# EAGLE schematic TommyPROM-nano (EAGLE 8.0.0)
Tom's EPROM programmer hosted on Arduino Nano.
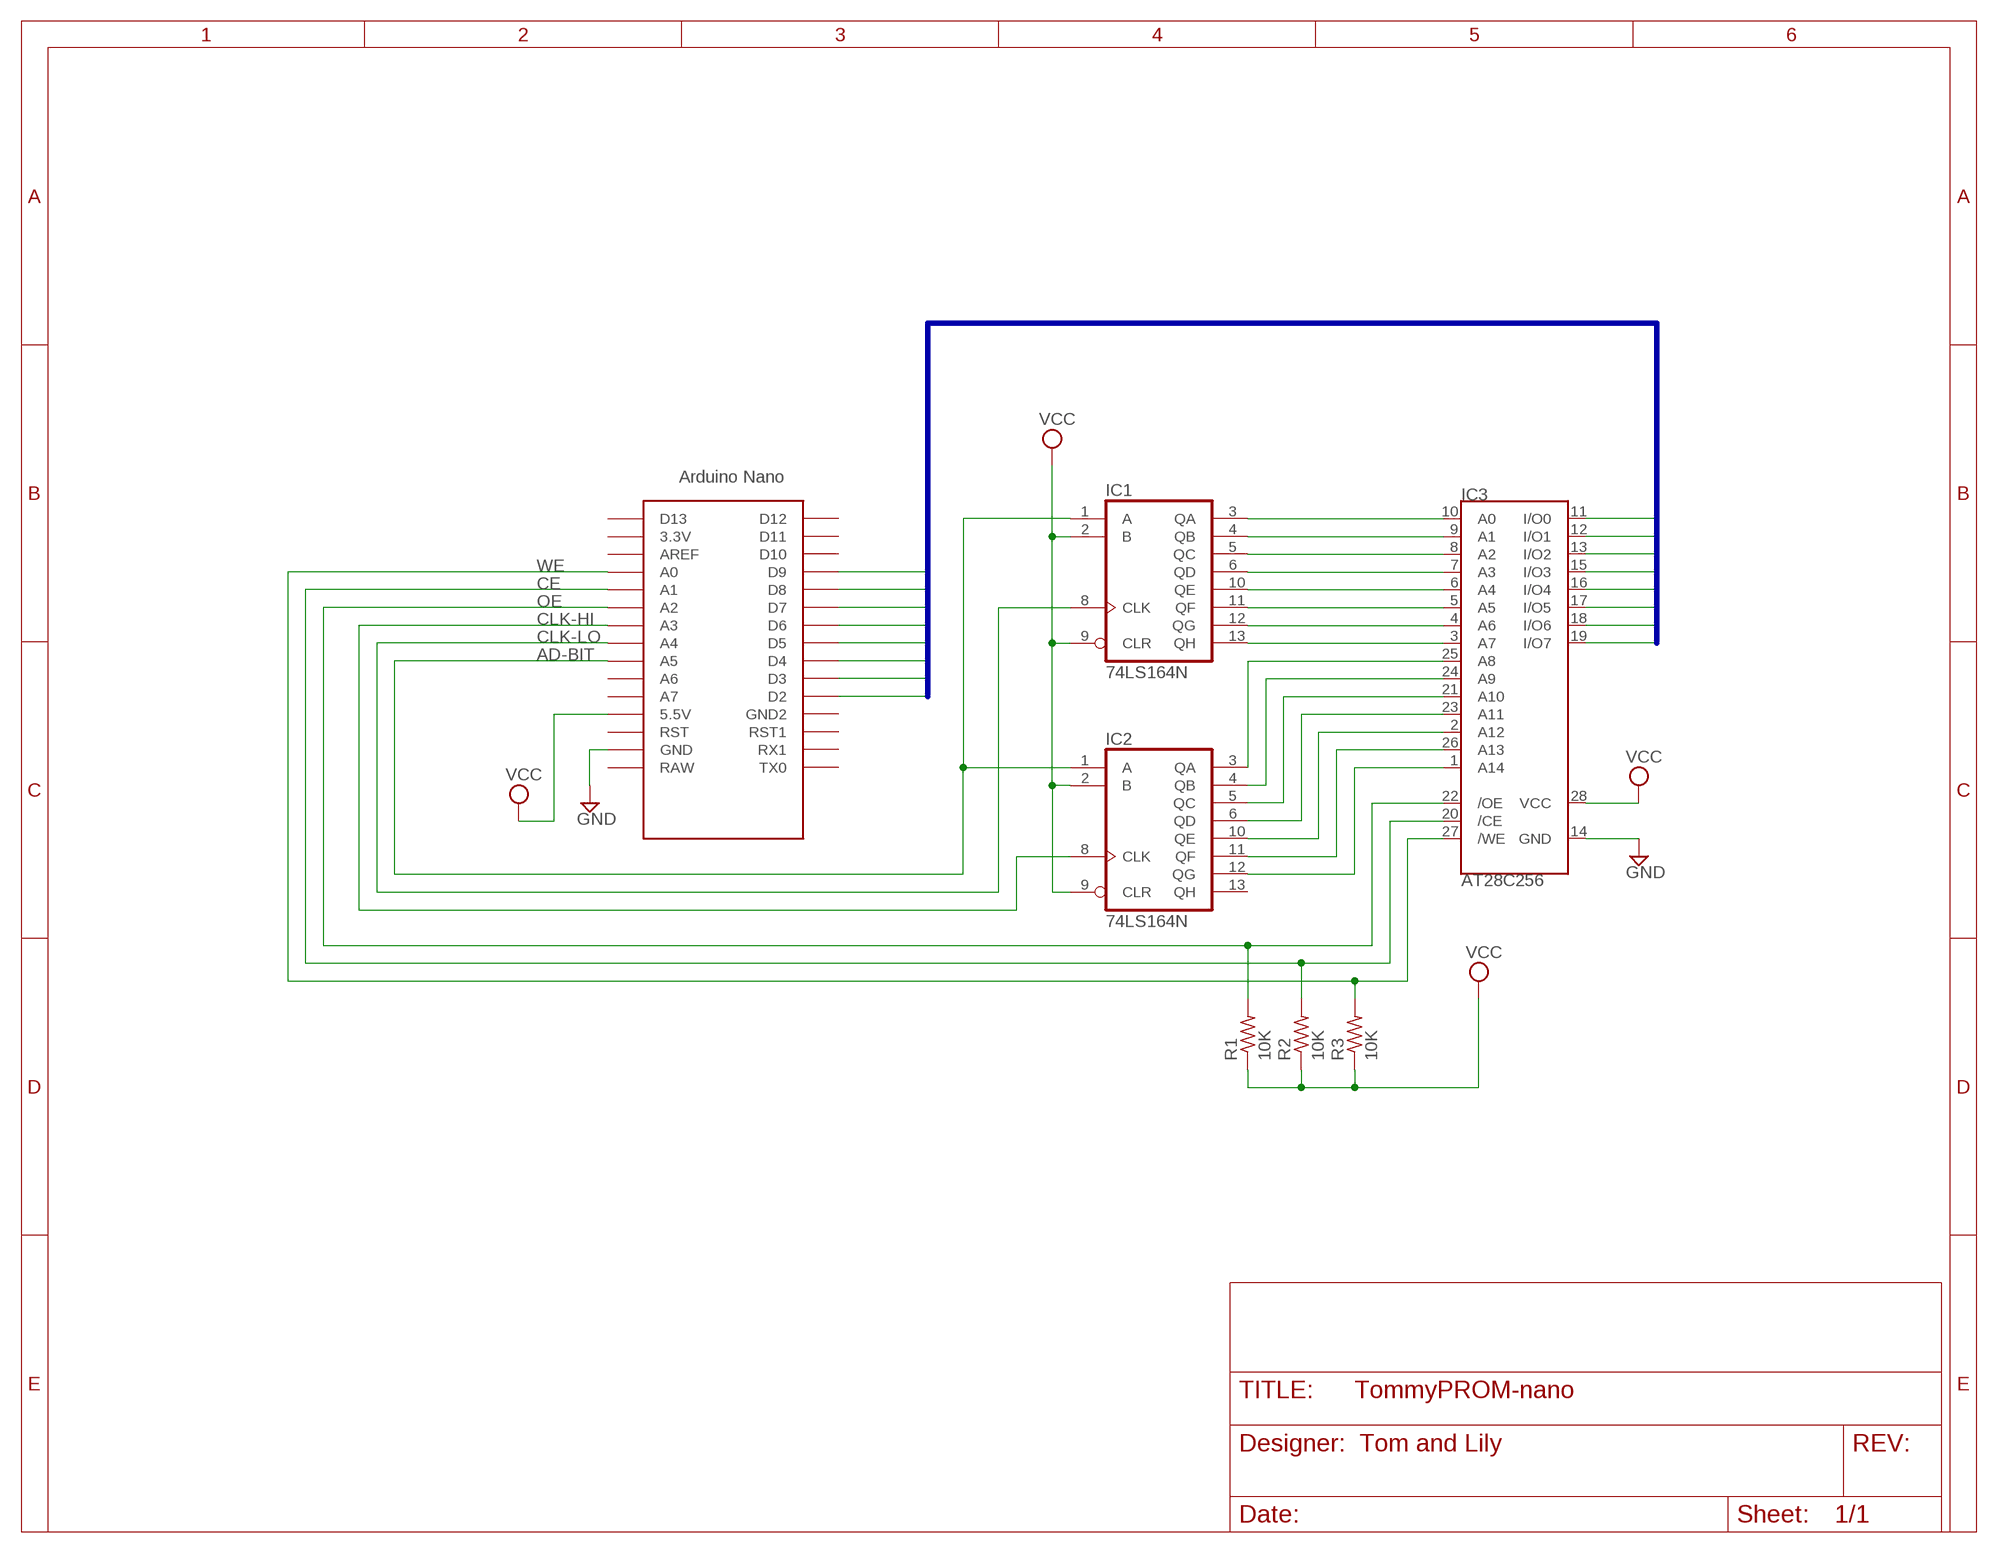
[diagram p0: schematic, sheet 1]

## Parts
IC1  74LS164N  [DIL14]
IC2  74LS164N  [DIL14]
IC3  AT28C256  AT28C256-28DIP  [DIL28-6]
R1  10K  R-US_0204/5  [0204/5]
R2  10K  R-US_0204/5  [0204/5]
R3  10K  R-US_0204/5  [0204/5]
U$2  NANO  [NANO]

## Nets
AD-BIT: IC1.1(A) IC2.1(A)
CE: IC3.20(/CE) R2.2
CLK-HI: IC2.8(CLK)
CLK-LO: IC1.8(CLK)
D0: IC3.11(I/O0)
D1: IC3.12(I/O1)
D2: IC3.13(I/O2)
D3: IC3.15(I/O3)
D4: IC3.16(I/O4)
D5: IC3.17(I/O5)
D6: IC3.18(I/O6)
D7: IC3.19(I/O7)
GND: IC3.14(GND)
N$6: IC2.12(QG) IC3.1(A14)
N$7: IC2.11(QF) IC3.26(A13)
N$8: IC2.10(QE) IC3.2(A12)
N$9: IC2.6(QD) IC3.23(A11)
N$10: IC2.5(QC) IC3.21(A10)
N$15: IC2.4(QB) IC3.24(A9)
N$16: IC2.3(QA) IC3.25(A8)
N$17: IC1.13(QH) IC3.3(A7)
N$18: IC1.12(QG) IC3.4(A6)
N$19: IC1.11(QF) IC3.5(A5)
N$20: IC1.10(QE) IC3.6(A4)
N$21: IC1.6(QD) IC3.7(A3)
N$22: IC1.5(QC) IC3.8(A2)
N$23: IC1.4(QB) IC3.9(A1)
N$24: IC1.3(QA) IC3.10(A0)
OE: IC3.22(/OE) R1.2
VCC: IC1.2(B) IC1.9(CLR) IC2.2(B) IC2.9(CLR) IC3.28(VCC) R1.1 R2.1 R3.1
WE: IC3.27(/WE) R3.2
Unconnected: IC2.13(QH) U$2.3.3V U$2.5V(5.5V) U$2.A0 U$2.A1 U$2.A2 U$2.A3 U$2.A4 U$2.A5 U$2.A6 U$2.A7 U$2.AREF U$2.D2 U$2.D3 U$2.D4 U$2.D5 U$2.D6 U$2.D7 U$2.D8 U$2.D9 U$2.D10 U$2.D11 U$2.D12 U$2.D13 U$2.GND U$2.GND1(GND2) U$2.ICSP1 U$2.ICSP2 U$2.ICSP3 U$2.ICSP4 U$2.ICSP5 U$2.ICSP6 U$2.RAW U$2.RST U$2.RST1 U$2.RX1 U$2.TX0

## Buses
D[0..7]

## Power pins joined to a net without a drawn wire
GND: IC1.7(GND) IC2.7(GND)
VCC: IC1.14(VCC) IC2.14(VCC)

## Library data of the parts
IC1 IC2 = 74xx-us:74*164: 8-bit parallel out SHIFT REGISTER
IC3 = mylib_memory:AT28C256-28DIP: IC EEPROM 256KBIT 28DIP
R1-R3 = resistor:R-US_: RESISTOR, American symbol
U$2 = Arduino-clone:NANO: Arduino Nano